# EAGLE design ar_env (EAGLE 7.7.0)
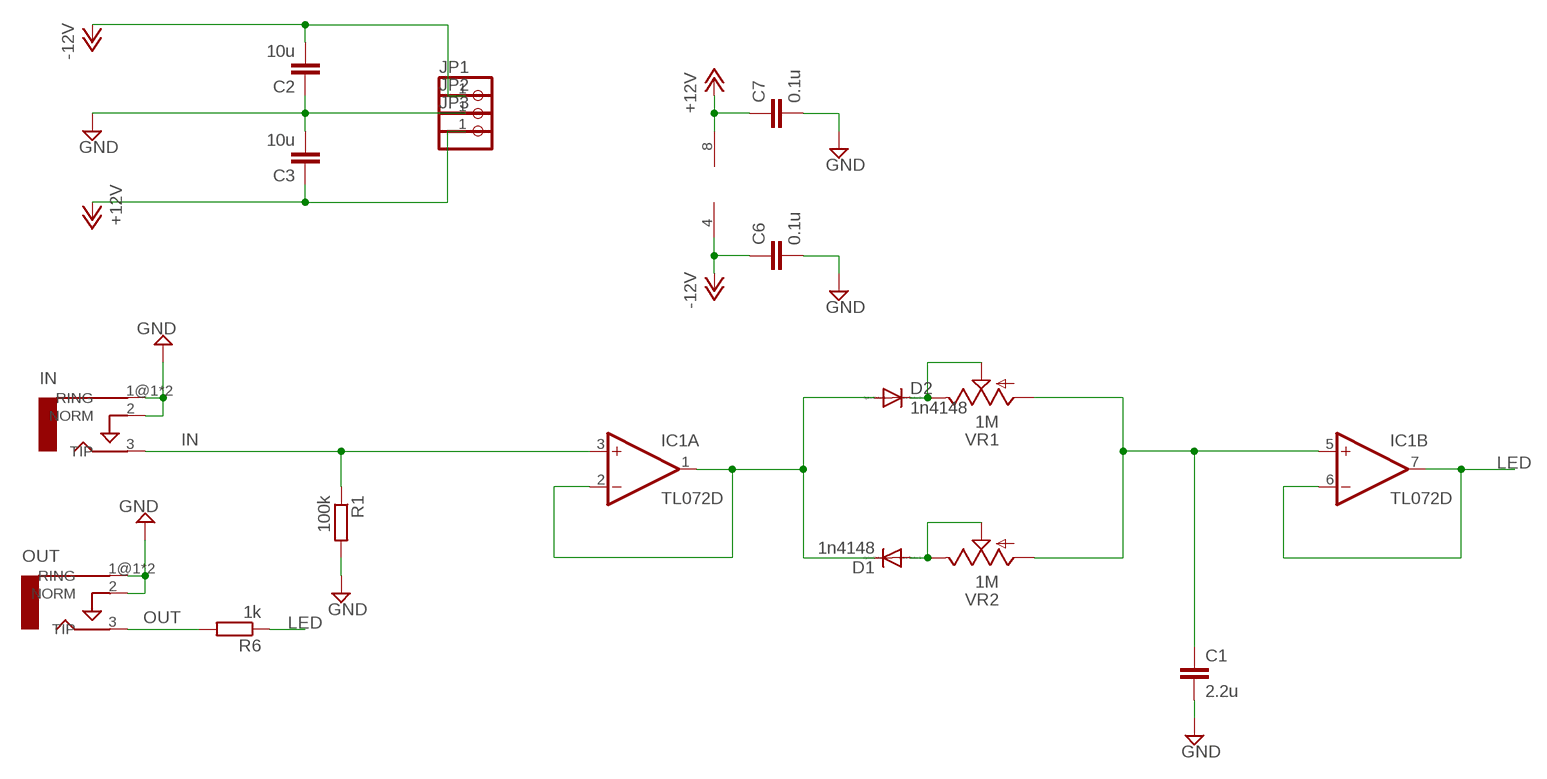
[diagram p0: schematic, sheet 1]

## Parts
C1  2.2u  C-EUC0805  [C0805]
C2  10u  C-EUC0805  [C0805]
C3  10u  C-EUC0805  [C0805]
C6  0.1u  C-EUC0805  [C0805]
C7  0.1u  C-EUC0805  [C0805]
D1  1n4148  DIODE-SOD323-W  [SOD323-W]
D2  1n4148  DIODE-SOD323-W  [SOD323-W]
IC1  TL072D  [SO08]
IN  AUDIO-JACKERTHENVAR  [ERTHENVAR-JACK]
JP1  PINHD-1X1  [1X01]
JP2  PINHD-1X1  [1X01]
JP3  PINHD-1X1  [1X01]
OUT  AUDIO-JACKERTHENVAR  [ERTHENVAR-JACK]
R1  100k  R-EU_R0805  [R0805]
R6  1k  R-EU_R0805  [R0805]
VR1  1M  9MM_SNAP-IN_POT_  [9MM_SNAP-IN_POT]
VR2  1M  9MM_SNAP-IN_POT_  [9MM_SNAP-IN_POT]

## Nets
+12V: C3.1 C7.1 IC1.8(P:V+) JP3.1
-12V: C2.2 C6.1 IC1.4(P:V-) JP1.1
GND: C1.2 C2.1 C3.2 C6.2 C7.2 IN.1@1(RING) IN.1@2(RING) IN.2(NORM) JP2.1 OUT.1@1(RING) OUT.1@2(RING) OUT.2(NORM) R1.2
IN: IC1.3(A:+IN) IN.3(TIP) R1.1
LED: IC1.6(B:-IN) IC1.7(B:OUT) R6.1
N$1: D2.C VR1.2(S) VR1.3(E)
N$2: D1.A VR2.2(S) VR2.3(E)
N$3: D1.C D2.A IC1.1(A:OUT) IC1.2(A:-IN)
N$5: C1.1 IC1.5(B:+IN) VR1.1(A) VR2.1(A)
OUT: OUT.3(TIP) R6.2

## Library data of the parts
C1-C3 C6 C7 = rcl:C-EU: CAPACITOR, European symbol
D1 D2 = diode:DIODE-: DIODE
IC1 = linear:TL072: OP AMP
IN OUT = erthenvar:AUDIO-JACK: Switching Mono 3.5mm Audio Jack from Erthenvar.
JP1-JP3 = pinhead:PINHD-1X1: PIN HEADER
R1 R6 = rcl:R-EU_: RESISTOR, European symbol
VR1 VR2 = MusicThingModular:9MM_SNAP-IN_POT: 9mm vertical snap-in pot, Alpha / Panasonic style

## Board
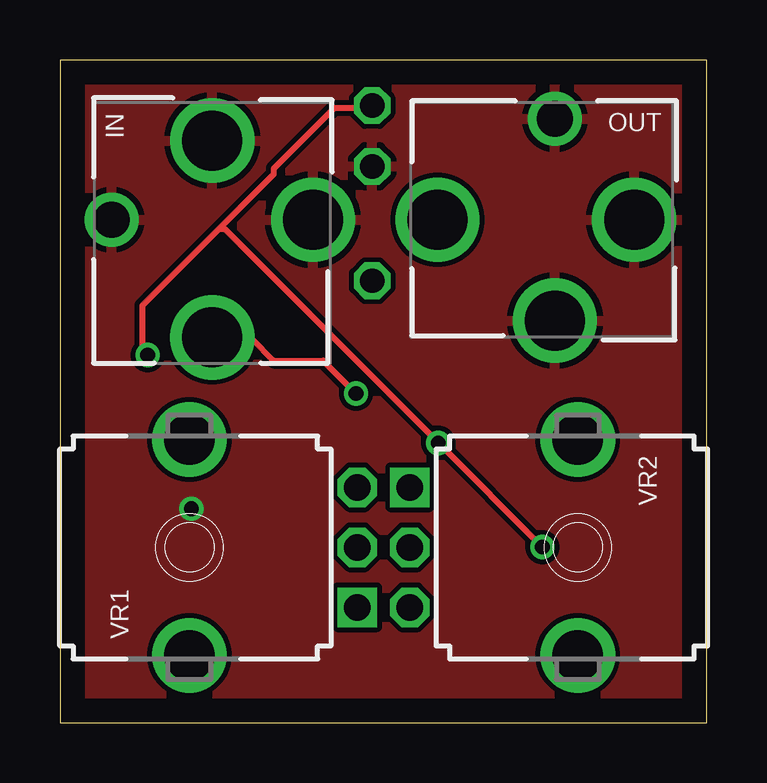
[diagram p1: board, top side]
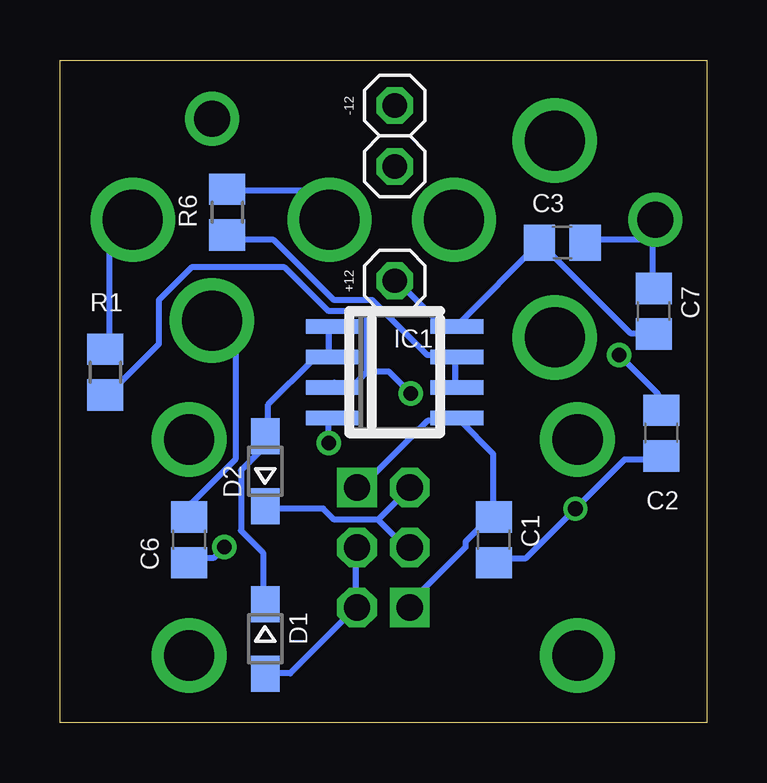
[diagram p2: board, bottom side, seen from below]

Size 26.98 x 27.61 mm. Coordinates in mm from the lower left corner, seen from the top.
Outline: 0,0 26.98,0 26.98,27.61 0,27.61 0,0
Copper layers (1*16): Top 0.035mm / dielectric 1.5mm / Bottom 0.035mm
Design rules "default": minimum track width 10mil, minimum drill 24mil, track to track 8mil, track to pad 8mil, pad to pad 8mil, via to via 8mil, smd to smd 8mil, copper to edge 40mil, drill to drill 8mil, minimum pad ring 10mil, minimum via ring 8mil, stop-mask expansion 4mil, vias tented up to drill 0mil, thermal gap 10mil

### Footprints (pad centres in the part's own frame; a part is rotated, then mirrored left to right if it is on the bottom)
C0805 = smd 1.3 x 1.5: 1 -0.95,0; 2 0.95,0
SOD323-W = smd 1.5 x 1.2: A 1.45,0; C -1.45,0
SO08 = smd 0.6 x 2.2: 1 -1.905,-2.6; 2 -0.635,-2.6; 3 0.635,-2.6; 4 1.905,-2.6; 5 1.905,2.6; 6 0.635,2.6; 7 -0.635,2.6; 8 -1.905,2.6
ERTHENVAR-JACK = drill 2.5: 1@1 -4.2,0; 2 0,-3.3; 3 0,4.9 | drill 1.5: 1@2 4.2,0
1X01 = drill 1.016 octagon: 1 0,0
R0805 = smd 1.3 x 1.5: 1 -0.95,0; 2 0.95,0
9MM_SNAP-IN_POT = drill 1.1 square: 1 -2.5,-7 | drill 1.1 octagon: 2 0,-7; 3 2.5,-7 | drill 2.1 pad 2.794: CHASSIS1 -4.5,0; CHASSIS2 4.5,0

### Placement (x,y rotation side)
C1  8.89,7.62 270 bottom
C2  1.91,12.06 90 bottom
C3  6.03,20 0 bottom
C6  21.59,7.62 90 bottom
C7  2.22,17.14 90 bottom
D1  18.41,3.49 270 bottom
D2  18.41,10.48 90 bottom
IC1  13.02,14.61 270 bottom
IN  6.35,20.95 180 top
JP1  13.02,25.72 0 bottom
JP2  13.02,23.18 0 bottom
JP3  13.02,18.41 0 bottom
OUT  20.64,20.95 90 top
R1  25.08,14.61 90 bottom
R6  20,21.27 90 bottom
VR1  5.4,7.3 90 top
VR2  21.59,7.3 270 top

### Tracks (layer width: path | path; a pad name or v marks a point on that pad's centre or on a via)
+12V
  Bottom 0.254: JP3.1 12.8,18.29 11.2,16.69 10.52,16.69 IC1.8 10.29,16.69 7.09,19.89 C3.1 6.86,19.89 3.2,16.23 2.29,16.23 C7.1
-12V  (via drill 0.61)
  Top 0.254: v3.66,15.32 3.43,15.54 3.43,17.37 6.63,20.57 | 6.63,20.57 8.91,22.86 8.91,23.09 11.43,25.6 12.8,25.6 JP1.1 | v20.12,7.32 v15.77,11.66 6.86,20.57 6.63,20.57
  Bottom 0.254: v3.66,15.32 2.06,13.72 2.06,13.03 C2.2 | v20.12,7.32 20.57,6.86 21.49,6.86 C6.1 | v15.77,11.66 15.77,12.57 IC1.4
GND  (via drill 0.61)
  Bottom 0.254: C2.1 2.06,10.97 3.43,10.97 v5.49,8.91 7.54,6.86 8.69,6.86 C1.2 | C6.2 21.49,8.69 21.49,9.14 19.66,10.97 19.66,15.77 20.57,16.69 OUT.1@1 | R1.2 24.92,15.77 24.92,19.89 24,20.8 OUT.2 | 2.29,20.12 2.29,20.8 IN.1@2 2.29,20.12 | 2.29,20.12 2.29,18.29 C7.2 | 2.29,20.12 5.03,20.12 C3.2
  pour Top: -0.32,27.62 27.3,27.62 27.3,0 -0.32,0
IN  (via drill 0.61)
  Top 0.254: v12.34,13.72 10.97,15.09 8.91,15.09 8,16 6.4,16 IN.3
  Bottom 0.254: 14.17,14.63 14.17,17.14 15.77,17.14 17.6,18.97 21.49,18.97 22.86,17.6 22.86,15.77 24.92,13.72 R1.1 | 14.17,14.63 14.63,14.17 15.54,14.17 IC1.3 | 14.17,14.63 13.26,14.63 v12.34,13.72
LED
  Bottom 0.254: R6.1 19.89,20.12 18.06,20.12 15.54,17.6 13.95,17.6 11.66,15.32 10.52,15.32 IC1.7 10.52,15.09 10.52,14.17 IC1.6
N$1
  Bottom 0.254: 13.72,8.46 15.54,8.46 16,8.91 18.29,8.91 D2.C | 13.72,8.46 12.57,9.6 VR1.3 | 13.72,8.46 12.57,7.32 VR1.2
N$2
  Bottom 0.254: D1.A 18.29,2.06 17.37,2.06 14.63,4.8 VR2.3 14.63,5.03 14.63,7.09 VR2.2
N$3
  Bottom 0.254: IC1.1 15.77,16.46 15.77,15.32 IC1.2 15.77,15.09 16.46,15.09 18.29,13.26 18.29,12.12 D2.A 18.52,11.89 18.52,11.43 19.43,10.52 19.43,8 18.52,7.09 18.52,5.03 D1.C
N$5
  Bottom 0.254: 8.91,8.69 8.91,11.2 10.29,12.57 IC1.5 10.52,12.57 11.66,12.57 14.4,9.83 VR2.1 | 8.91,8.69 10.06,7.54 10.06,7.32 12.34,5.03 VR1.1 | 8.91,8.69 C1.1
OUT
  Bottom 0.254: R6.2 19.89,22.17 16.92,22.17 15.77,21.03 OUT.3

### Text on the board
bNames: -12 | +12